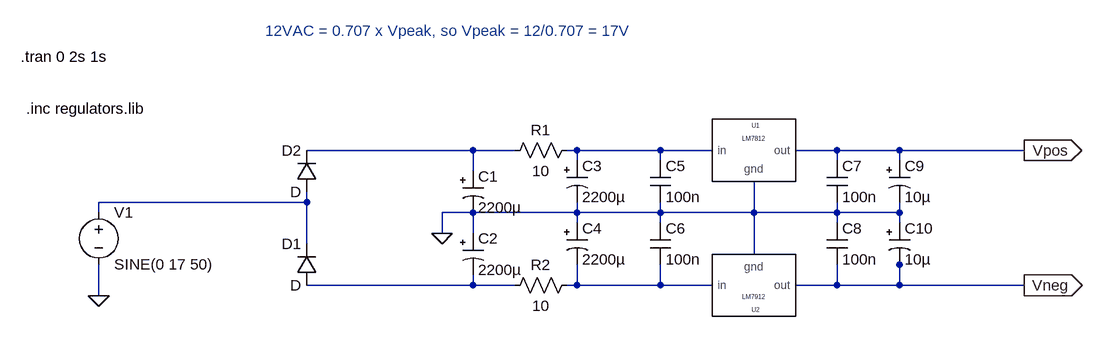
[diagram p0: schematic PSU.asc]
PSU.asc, the LTspice schematic file:
Version 4
SHEET 1 1700 680
WIRE 560 160 304 160
WIRE 624 160 560 160
WIRE 720 160 704 160
WIRE 848 160 720 160
WIRE 928 160 848 160
WIRE 1120 160 1056 160
WIRE 1216 160 1120 160
WIRE 1408 160 1216 160
WIRE 720 176 720 160
WIRE 848 176 848 160
WIRE 1120 176 1120 160
WIRE 1216 176 1216 160
WIRE 560 192 560 160
WIRE 304 240 304 224
WIRE 304 240 -16 240
WIRE -16 256 -16 240
WIRE 560 256 512 256
WIRE 720 256 720 240
WIRE 720 256 560 256
WIRE 848 256 848 240
WIRE 848 256 720 256
WIRE 992 256 992 208
WIRE 992 256 848 256
WIRE 1120 256 1120 240
WIRE 1120 256 992 256
WIRE 1216 256 1216 240
WIRE 1216 256 1120 256
WIRE 720 272 720 256
WIRE 848 272 848 256
WIRE 1120 272 1120 256
WIRE 1216 272 1216 256
WIRE 512 288 512 256
WIRE 560 288 560 256
WIRE 304 304 304 240
WIRE 992 320 992 256
WIRE 1216 336 1216 320
WIRE 560 368 560 352
WIRE 560 368 304 368
WIRE 624 368 560 368
WIRE 720 368 720 336
WIRE 720 368 704 368
WIRE 848 368 848 336
WIRE 848 368 720 368
WIRE 928 368 848 368
WIRE 1120 368 1120 336
WIRE 1120 368 1056 368
WIRE 1216 368 1216 336
WIRE 1216 368 1120 368
WIRE 1408 368 1216 368
WIRE -16 384 -16 336
FLAG -16 384 0
FLAG 1408 368 Vneg
IOPIN 1408 368 Out
FLAG 1408 160 Vpos
IOPIN 1408 160 Out
FLAG 512 288 0
SYMBOL voltage -16 240 R0
SYMATTR InstName V1
SYMATTR Value SINE(0 17 50)
SYMATTR Value2 AC 12
SYMBOL Diode 320 224 R180
WINDOW 0 24 64 Left 2
WINDOW 3 24 0 Left 2
SYMATTR InstName D2
SYMBOL Diode 320 368 R180
WINDOW 0 24 64 Left 2
WINDOW 3 24 0 Left 2
SYMATTR InstName D1
SYMBOL polcap 544 192 R0
SYMATTR InstName C1
SYMATTR Value 2200µ
SYMBOL polcap 544 288 R0
SYMATTR InstName C2
SYMATTR Value 2200µ
SYMBOL Res 720 352 R90
WINDOW 0 0 56 VBottom 2
WINDOW 3 32 56 VTop 2
SYMATTR InstName R2
SYMATTR Value 10
SYMBOL Res 720 144 R90
WINDOW 0 0 56 VBottom 2
WINDOW 3 32 56 VTop 2
SYMATTR InstName R1
SYMATTR Value 10
SYMBOL polcap 704 176 R0
SYMATTR InstName C3
SYMATTR Value 2200µ
SYMBOL polcap 704 272 R0
SYMATTR InstName C4
SYMATTR Value 2200µ
SYMBOL Cap 832 176 R0
SYMATTR InstName C5
SYMATTR Value 100n
SYMBOL Cap 832 272 R0
SYMATTR InstName C6
SYMATTR Value 100n
SYMBOL LM7812 1056 176 R0
SYMATTR InstName U1
SYMBOL LM7912 1056 352 M180
SYMATTR InstName U2
SYMBOL Cap 1104 176 R0
SYMATTR InstName C7
SYMATTR Value 100n
SYMBOL Cap 1104 272 R0
SYMATTR InstName C8
SYMATTR Value 100n
SYMBOL polcap 1200 176 R0
SYMATTR InstName C9
SYMATTR Value 10µ
SYMBOL polcap 1200 272 R0
SYMATTR InstName C10
SYMATTR Value 10µ
TEXT -136 16 Left 2 !.tran 0 2s 1s
TEXT -128 96 Left 2 !.inc regulators.lib
TEXT 240 -24 Left 2 ;12VAC = 0.707 x Vpeak, so Vpeak = 12/0.707 = 17V

The netlist it stands for:
* PSU.asc
V1 N003 0 SINE(0 17 50) AC 12
D2 N003 N001 D
D1 N004 N003 D
C1 N001 0 2200µ
C2 0 N004 2200µ
R2 N005 N004 10
R1 N002 N001 10
C3 N002 0 2200µ
C4 0 N005 2200µ
C5 N002 0 100n
C6 0 N005 100n
XU1 N002 0 Vpos LM7812  ; pins in gnd out
XU2 N005 0 Vneg LM7912  ; pins in gnd out
C7 Vpos 0 100n
C8 0 Vneg 100n
C9 Vpos 0 10µ
C10 0 Vneg 10µ
.model D D
.lib standard.dio
.tran 0 2s 1s
.inc regulators.lib
* 12VAC = 0.707 x Vpeak, so Vpeak = 12/0.707 = 17V
.lib regulators.lib
.backanno
.end